# EAGLE design breakout_BGM111 (EAGLE 7.4.0)
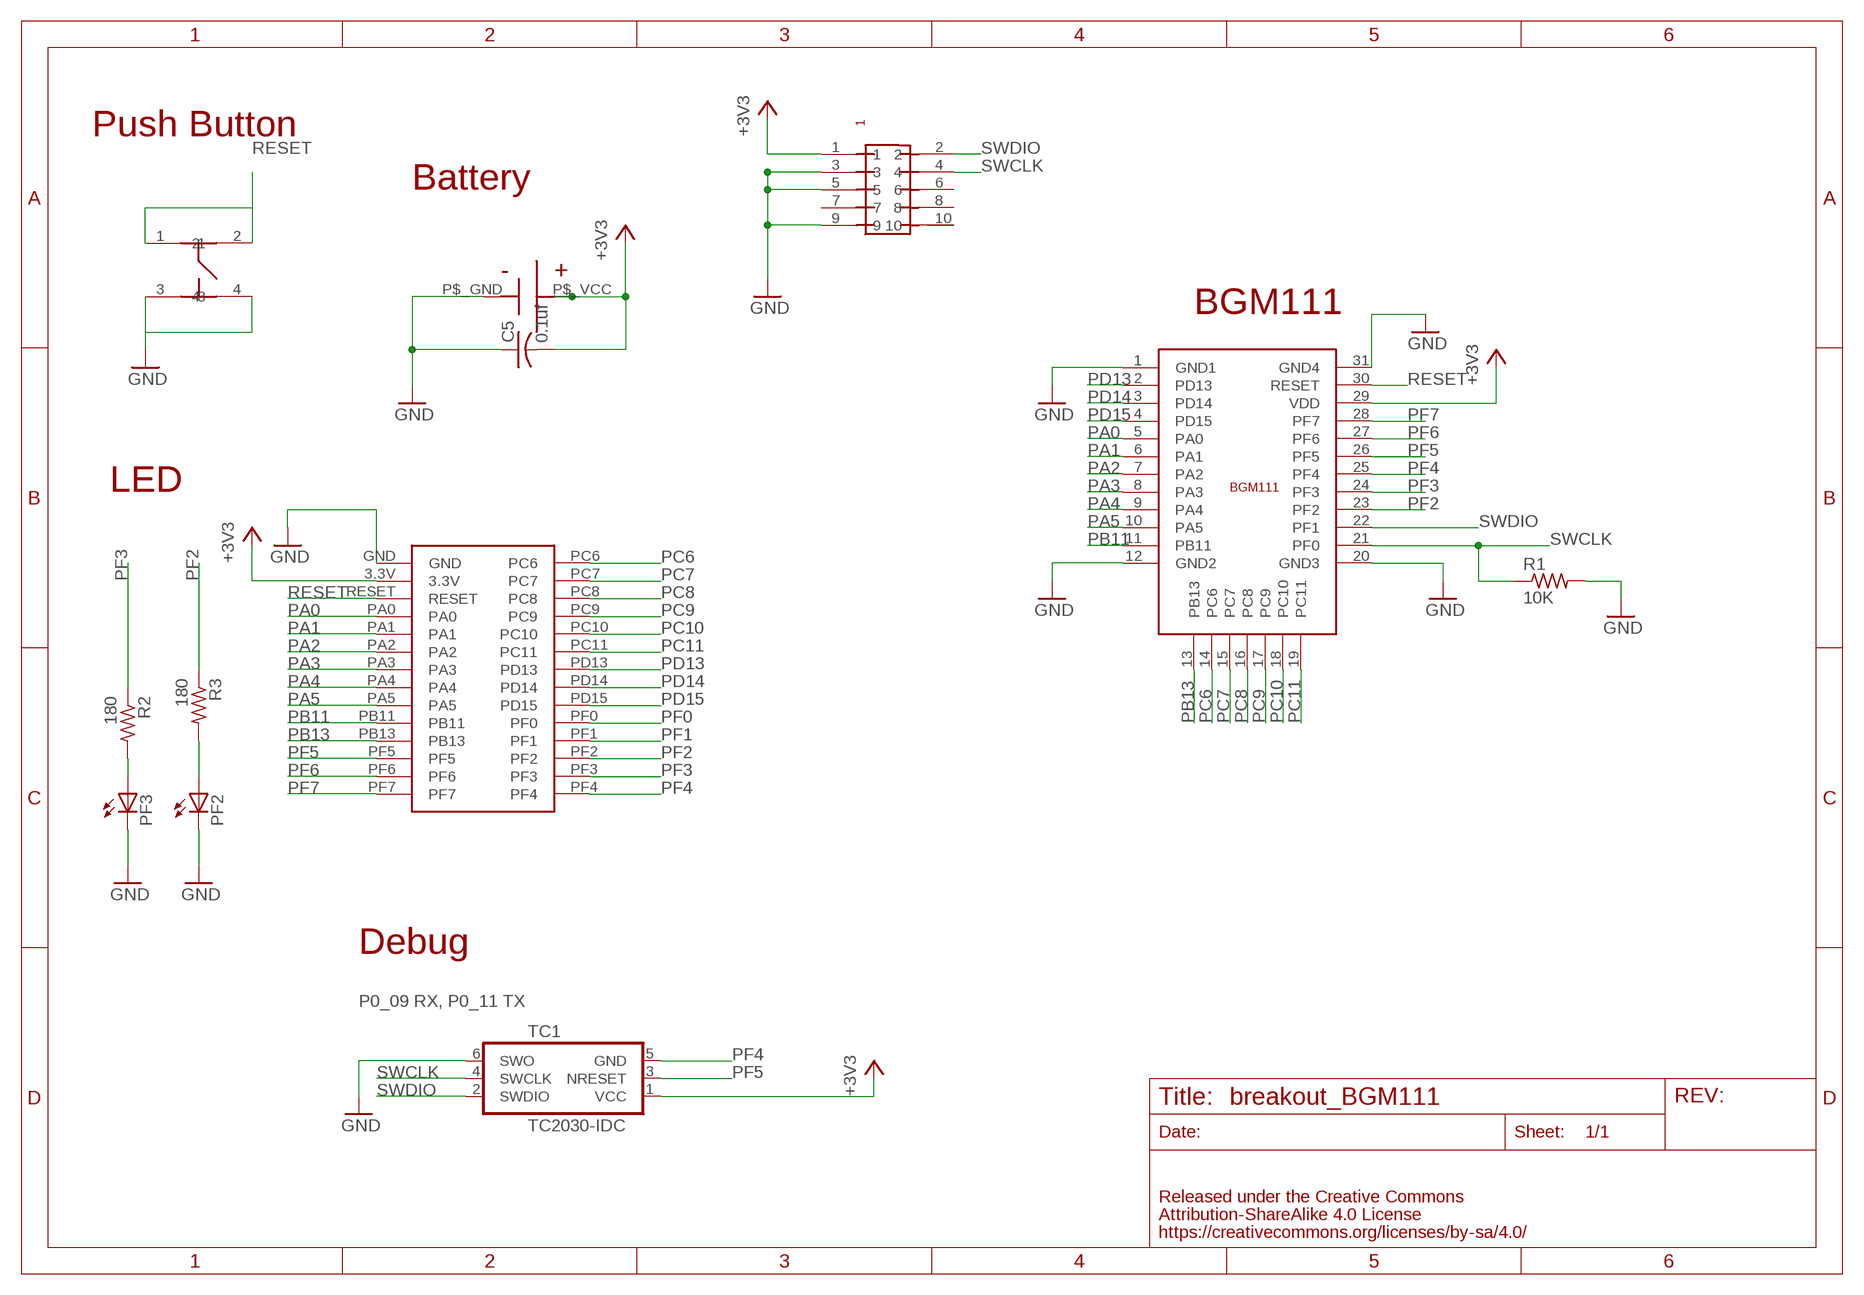
[diagram p0: schematic, sheet 1]

## Parts
C5  0.1uf  C-USC0603  [C0603]
PF2  LEDCHIP-LED0603  [CHIP-LED0603]
PF3  LEDCHIP-LED0603  [CHIP-LED0603]
R1  10K  R-US_R0603  [R0603]
R2  180  R-US_R0603  [R0603]
R3  180  R-US_R0603  [R0603]
TC1  TC2030-IDC  [TC2030-IDC]
U$1  SILICONLABS-BGM111  [SILICONLABS-BGM111]
U$2  SMTU2450-TOP  [SMTU2450]
U$3  BLE-BREAKOUT-NORDIC  [BLE-BREAKOUT-SILICONLABS]
U$4  PIN-HEADER-SMT(1.27MM)2X5  [PIN-HEADER-SMT(1.27MM)2X5]
U$5  SWICTH-4P(KMR2)  [SWITCH-4P(KMR2)]

## Nets
+3V3: C5.2 TC1.1(VCC) U$1.29(VDD) U$2.P$_VCC(+) U$3.3.3V U$4.1
GND: C5.1 PF2.C PF3.C R1.2 TC1.6(SWO) U$1.1(GND1) U$1.12(GND2) U$1.20(GND3) U$1.31(GND4) U$2.P$_GND(-) U$3.GND U$4.3 U$4.5 U$4.9 U$5.3 U$5.4
N$1: PF3.A R2.2
N$2: PF2.A R3.2
PA0: U$1.5(PA0) U$3.PA0
PA1: U$1.6(PA1) U$3.PA1
PA2: U$1.7(PA2) U$3.PA2
PA3: U$1.8(PA3) U$3.PA3
PA4: U$1.9(PA4) U$3.PA4
PA5: U$1.10(PA5) U$3.PA5
PB11: U$1.11(PB11) U$3.PB11
PB13: U$1.13(PB13) U$3.PB13
PC6: U$1.14(PC6) U$3.PC6
PC7: U$1.15(PC7) U$3.PC7
PC8: U$1.16(PC8) U$3.PC8
PC9: U$1.17(PC9) U$3.PC9
PC10: U$1.18(PC10) U$3.PC10
PC11: U$1.19(PC11) U$3.PC11
PD13: U$1.2(PD13) U$3.PD13
PD14: U$1.3(PD14) U$3.PD14
PD15: U$1.4(PD15) U$3.PD15
PF0: U$3.PF0
PF1: U$3.PF1
PF2: R3.1 U$1.23(PF2) U$3.PF2
PF3: R2.1 U$1.24(PF3) U$3.PF3
PF4: TC1.5(GND) U$1.25(PF4) U$3.PF4
PF5: TC1.3(NRESET) U$1.26(PF5) U$3.PF5
PF6: U$1.27(PF6) U$3.PF6
PF7: U$1.28(PF7) U$3.PF7
RESET: U$1.30(RESET) U$3.RESET U$5.1 U$5.2
RESET1: U$4.10
SWCLK: R1.1 TC1.4(SWCLK) U$1.21(PF0) U$4.4
SWDIO: TC1.2(SWDIO) U$1.22(PF1) U$4.2
Unconnected: U$4.6 U$4.7 U$4.8

## Notes on the sheet
- Push Button
- Battery
- BGM111
- LED
- Debug
- P0_09 RX, P0_11 TX

## Library data of the parts
C5 = adafruit:C-US: CAPACITOR, American symbol
PF2 PF3 = led:LED: LED OSRAM: - CHIPLED LG R971, LG N971, LY N971, LG Q971, LY Q971, LO R971, LY R971 LH N974, LH R974 LS Q976, LO Q976, LY Q976 LO Q996 - Hyper CHIPLED LW Q18S LB Q993, LB Q99A, LB R99A - SideLED LS A670, LO A670, LY A670, LG A670, LP A670 LB A673, LV A673, LT A673, LW A673 LH A674 LY A675 LS A676, LA A676, LO A676, LY A676, LW A676 LS A679, LY A679, LG A679 - Hyper Micro SIDELED® LS Y876, LA Y876, LO Y876, LY Y876 LT Y87S - SmartLED LW L88C, LW L88S LB L89C, LB L89S, LG L890 LS L89K, LO L89K, LY L89K LS L896, LA L896, LO L896, LY L896 - TOPLED LS T670, LO T670, LY T670, LG T670, LP T670 LSG T670, LSP T670, LSY T670, LOP T670, LYG T670 LG T671, LOG T671, LSG T671 LB T673, LV T673, LT T673, LW T673 LH T674 LS T676, LA T676, LO T676, LY T676, LB T676, LH T676, LSB T676, LW T676 LB T67C, LV T67C, LT T67C, LS T67K, LO T67K, LY T67K, LW E67C LS E67B, LA E67B, LO E67B, LY E67B, LB E67C, LV E67C, LT E67C LW T67C LS T679, LY T679, LG T679 LS T770, LO T770, LY T770, LG T770, LP T770 LB T773, LV T773, LT T773, LW T773 LH T774 LS E675, LA E675, LY E675, LS T675 LS T776, LA T776, LO T776, LY T776, LB T776 LHGB T686 LT T68C, LB T68C - Hyper Mini TOPLED® LB M676 - Mini TOPLED Santana® LG M470 LS M47K, LO M47K, LY M47K Source: http://www.osram.convergy.de LUXEON: - LUMILED® LXK2-PW12-R00, LXK2-PW12-S00, LXK2-PW14-U00, LXK2-PW14-V00 LXK2-PM12-R00, LXK2-PM12-S00, LXK2-PM14-U00 LXK2-PE12-Q00, LXK2-PE12-R00, LXK2-PE12-S00, LXK2-PE14-T00, LXK2-PE14-U00 LXK2-PB12-K00, LXK2-PB12-L00, LXK2-PB12-M00, LXK2-PB14-N00, LXK2-PB14-P00, LXK2-PB14-Q00 LXK2-PR12-L00, LXK2-PR12-M00, LXK2-PR14-Q00, LXK2-PR14-R00 LXK2-PD12-Q00, LXK2-PD12-R00, LXK2-PD12-S00 LXK2-PH12-R00, LXK2-PH12-S00 LXK2-PL12-P00, LXK2-PL12-Q00, LXK2-PL12-R00 Source: www.luxeon.com KINGBRIGHT: KA-3528ASYC Source: www.kingbright.com
R1-R3 = adafruit:R-US_: RESISTOR, American symbol
TC1 = TagConnect:TC2030-IDC: Tag-Connect In Circuit Programming & Debug Cable 6 Pin http://www.tag-connect.com
U$1 = FaBo-BT:SILICONLABS-BGM111
U$2 = GClue-Supply:SMTU2450-TOP
U$3 = FaBo-Template:BLE-BREAKOUT-NORDIC
U$4 = gclue:PIN-HEADER-SMT(1.27MM)2X5: PIN-HEADER-SMT (1.27MM) 2x5
U$5 = gclue-test:SWICTH-4P(KMR2)

## Board
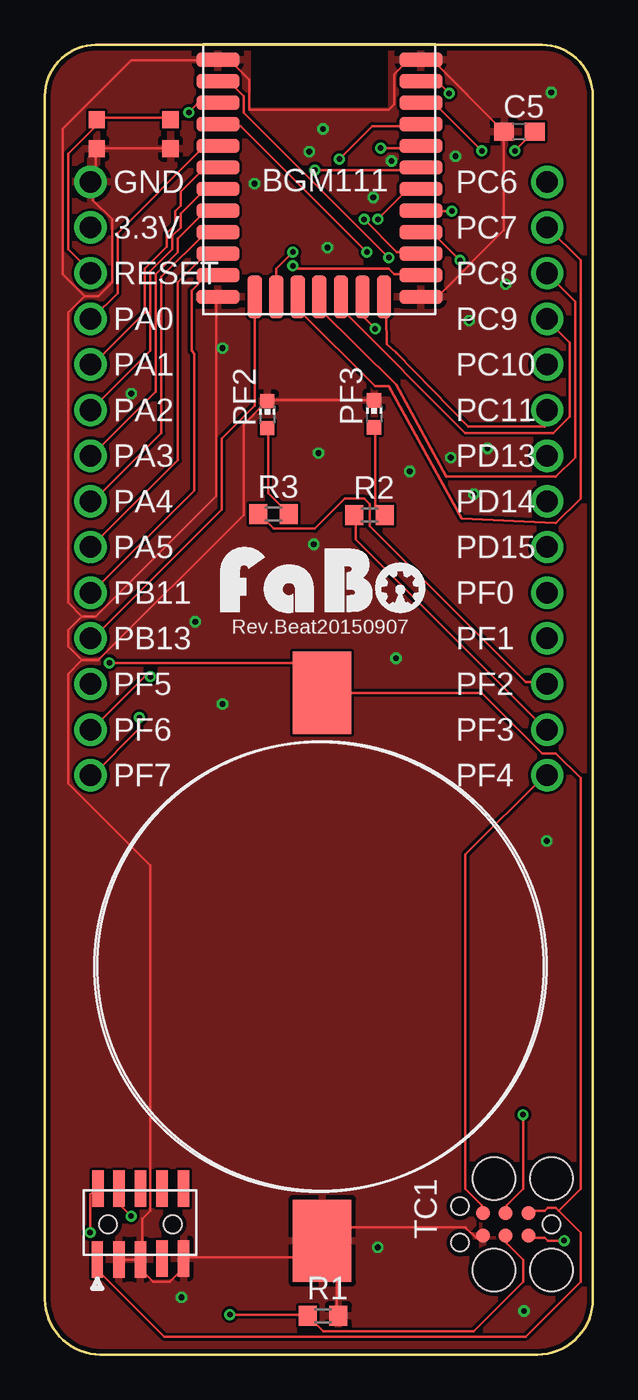
[diagram p1: board, top side]
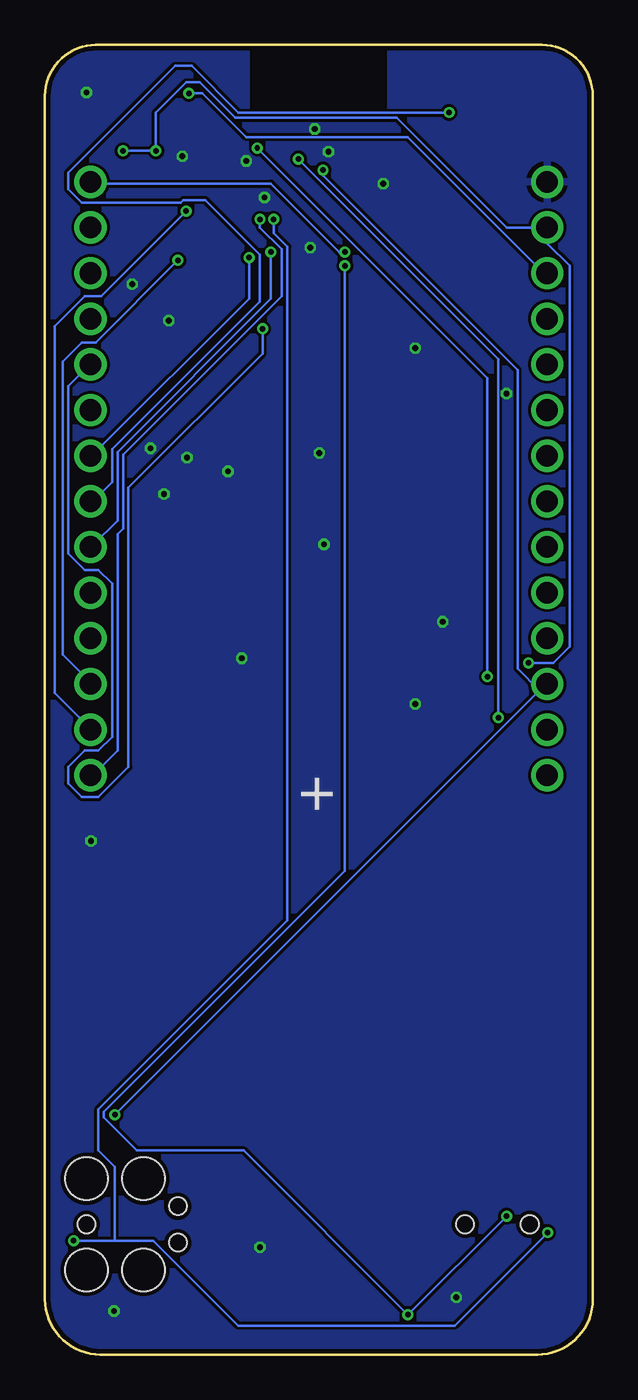
[diagram p2: board, bottom side, seen from below]

Size 30.48 x 72.88 mm. Coordinates in mm from the lower left corner, seen from the top.
Copper layers (1*16): Top 0.035mm / dielectric 1.5mm / Bottom 0.035mm
Design rules "SeeedStudio_2layer_DRU_no_angle_20140221": minimum track width 6mil, minimum drill 12mil, track to track 6mil, track to pad 6mil, pad to pad 6mil, via to via 6mil, smd to smd 0mil, copper to edge 10mil, drill to drill 10mil, minimum pad ring 10mil, minimum via ring 6mil, stop-mask expansion 2mil, vias tented up to drill 100mil, thermal gap 10mil

### Footprints (pad centres in the part's own frame; a part is rotated, then mirrored left to right if it is on the bottom)
C0603 = smd 1.1 x 1: 1 -0.85,0; 2 0.85,0
CHIP-LED0603 = smd 0.8 x 0.8: A 0,-0.75; C 0,0.75
R0603 = smd 1 x 1.1: 1 -0.85,0; 2 0.85,0
TC2030-IDC = smd 0.787 x 0.787: 1 -1.27,-0.635; 2 -1.27,0.635; 3 0,-0.635; 4 0,0.635; 5 1.27,-0.635; 6 1.27,0.635 | hole 0.991: -2.54,0; 2.54,1.016; 2.54,-1.016 | hole 2.375: -2.54,2.54; -2.54,-2.54; 0.635,2.54; 0.635,-2.54
SILICONLABS-BGM111 = smd 2.4 x 0.8: 1 -5.65,6.65; 2 -5.65,5.45; 3 -5.65,4.25; 4 -5.65,3.05; 5 -5.65,1.85; 6 -5.65,0.65; 7 -5.65,-0.55; 8 -5.65,-1.75; 9 -5.65,-2.95; 10 -5.65,-4.15; 11 -5.65,-5.35; 12 -5.65,-6.55; 20 5.65,-6.55; 21 5.65,-5.35; 22 5.65,-4.15; 23 5.65,-2.95; 24 5.65,-1.75; 25 5.65,-0.55; 26 5.65,0.65; 27 5.65,1.85; 28 5.65,3.05; 29 5.65,4.25; 30 5.65,5.45; 31 5.65,6.65 | smd 0.8 x 2.4: 13 -3.6,-6.55; 14 -2.4,-6.55; 15 -1.2,-6.55; 16 0,-6.55; 17 1.2,-6.55; 18 2.4,-6.55; 19 3.6,-6.55
SMTU2450 = smd 3.251 x 4.572: P$_GND 0,-15.29; P$_VCC 0,15.21
BLE-BREAKOUT-SILICONLABS = drill 1.2: 3.3V -12.7,26.67; GND -12.7,29.21; PA0 -12.7,21.59; PA1 -12.7,19.05; PA2 -12.7,16.51; PA3 -12.7,13.97; PA4 -12.7,11.43; PA5 -12.7,8.89; PB11 -12.7,6.35; PB13 -12.7,3.81; PC6 12.7,29.21; PC7 12.7,26.67; PC8 12.7,24.13; PC9 12.7,21.59; PC10 12.7,19.05; PC11 12.7,16.51; PD13 12.7,13.97; PD14 12.7,11.43; PD15 12.7,8.89; PF0 12.7,6.35; PF1 12.7,3.81; PF2 12.7,1.27; PF3 12.7,-1.27; PF4 12.7,-3.81; PF5 -12.7,1.27; PF6 -12.7,-1.27; PF7 -12.7,-3.81; RESET -12.7,24.13
PIN-HEADER-SMT(1.27MM)2X5 = smd 0.635 x 2.032: 1 -2.4,-1.95; 2 -2.35,2; 3 -1.2,-1.95; 4 -1.2,2; 5 0,-1.95; 6 0,2; 7 1.2,-1.9; 8 1.2,2; 9 2.4,-1.9; 10 2.4,2 | hole 1: 1.8,0; -1.8,0
SWITCH-4P(KMR2) = smd 0.9 x 0.95: 1 -1,0; 2 3.1,0; 3 -1,-1.6; 4 3.1,-1.6

### Placement (x,y rotation side)
C5  26.39,68.05 0 top
PF2  12.37,52.31 0 top
PF3  18.31,52.36 0 top
R1  15.47,2.17 0 top
R2  18.06,46.72 0 top
R3  12.73,46.77 0 top
TC1  25.63,7.25 180 top
U$1  15.27,65.41 0 top
U$2  15.42,21.62 0 top
U$3  15.24,36.05 0 top
U$4  5.31,7.25 0 top
U$5  3.89,68.71 0 top
U$7  [LOGO_FABO_M]  15.47,41.28 0 top

### Tracks (layer width: path | path; a pad name or v marks a point on that pad's centre or on a via)
+3V3  (via drill 0.3)
  Top 0.152: v26.14,66.99 27.2,68.05 C5.2 | v24.31,66.99 21.72,69.58 20.95,69.58 U$1.29 | 28.57,8.01 29.79,6.79 29.79,4.05 26.75,1 6.63,1 2.97,4.66 2.97,5.27 U$4.1 | 28.57,8.01 28.42,8.16 27.97,8.16 27.81,8.01 26.9,8.01 TC1.1 | 28.57,8.01 29.79,9.23 29.79,32.09 28.42,33.46 27.66,33.46 24.31,36.81 15.47,36.81 U$2.P$_VCC 15.32,36.96 13.79,38.49 v3.58,38.49
  Bottom 0.152: v26.14,66.99 v24.31,66.99 24.31,69.12 22.63,70.8 21.87,70.8 19.89,68.82 10.9,68.82 4.8,62.72 U$3.3.3V 2.51,62.72 2.51,61.81 1.3,60.59 1.3,39.4 2.21,38.49 v3.58,38.49
GND  (via drill 0.32)
  Top 0.152: 25.53,68.05 21.56,72.02 20.95,72.02 U$1.31 20.8,72.02 20.19,72.02 19.43,71.25 19.43,69.58 19.13,69.27 11.35,69.27 11.35,70.95 10.29,72.02 9.68,72.02 U$1.1 9.52,72.02 4.8,72.02 0.99,68.21 0.99,60.13 2.21,58.91 | 25.53,68.05 25.53,62.57 21.87,58.91 20.95,58.91 U$1.20 | 25.53,68.05 C5.1 | U$4.3 4.19,5.27 5.26,5.27 U$4.5 | U$4.5 5.41,5.27 5.41,4.66 6.02,4.05 6.93,4.05 7.7,4.81 7.7,5.27 U$4.9 7.85,5.42 14.4,5.42 15.32,6.33 U$2.P$_GND | TC1.6 24.31,6.48 24,6.48 23.39,7.09 16.08,7.09 15.47,6.48 U$2.P$_GND | R1.2 16.23,2.22 16.23,5.57 15.47,6.33 U$2.P$_GND | U$5.4 6.93,67.14 2.97,67.14 U$5.3 2.82,66.99 2.82,65.46 2.67,65.31 U$3.GND 2.67,65.16 2.67,64.24 3.73,63.18 3.73,59.67 2.97,58.91 2.21,58.91 | PF3.C 18.21,53.12 12.42,53.12 PF2.C 12.27,52.97 11.05,51.75 11.05,46.72 2.97,38.64 2.06,38.64 | 2.06,41.08 2.82,41.08 9.52,47.78 9.52,58.76 U$1.12 | 2.06,41.08 1.3,40.32 1.3,39.4 2.06,38.64 | 2.21,58.91 1.3,58 1.3,41.84 2.06,41.08 | 2.06,38.64 1.3,37.88 1.3,31.78 5.87,27.21 5.87,8.01 5.41,7.55 5.41,5.42 U$4.5
  other vias: 9.88,36.2 8.36,40.77 19.53,38.74 15.21,50.17 14.96,45.09 27.91,28.58 18.52,5.98 26.64,2.42 7.59,3.18 15.72,61.6 11.66,65.16 28.17,70.24 22.83,66.68 14.71,66.94 9.88,56.01 4.8,53.47 23.6,57.54 25.63,59.57 15.47,68.21 18.26,64.4 19.28,66.43 20.29,49.16 22.58,49.92 24.61,50.43 23.85,47.89
  pour Top: -2.31,-0.37 33.25,-0.37 33.25,73.29 -2.31,73.29
  pour Bottom: -2.31,-0.37 33.25,-0.37 33.25,73.29 -2.31,73.29
N$1
  Top 0.152: PF3.A 18.36,51.59 18.36,47.18 18.82,46.72 R2.2
N$2
  Top 0.152: PF2.A 12.42,51.44 12.42,47.94 13.49,46.87 R3.2
PA0
  Top 0.152: U$1.5 9.52,67.14 8.76,67.14 4.04,62.42 4.04,59.06 2.67,57.69 U$3.PA0
PA1
  Top 0.152: U$1.6 9.52,65.92 8.76,65.92 7.54,64.7 7.54,63.94 7.24,63.63 7.24,62.87 6.78,62.42 6.78,61.65 5.56,60.43 5.56,58 2.67,55.1 U$3.PA1
PA2
  Top 0.152: U$1.7 9.52,64.85 8.92,64.85 7.54,63.48 7.54,62.72 7.09,62.26 7.09,61.5 5.87,60.28 5.87,55.86 2.67,52.66 U$3.PA2
PA3
  Top 0.152: U$1.8 9.52,63.63 8.92,63.63 7.39,62.11 7.39,61.35 6.17,60.13 6.17,53.58 2.67,50.07 U$3.PA3
PA4
  Top 0.152: U$1.9 9.52,62.42 8.92,62.42 6.48,59.98 6.48,51.29 2.67,47.48 U$3.PA4
PA5
  Top 0.152: U$1.10 9.52,61.2 8.92,61.2 7.39,59.67 7.39,49.77 2.67,45.04 U$3.PA5
PB11
  Top 0.152: U$1.11 9.52,59.98 8.92,59.98 8.15,59.21 8.15,55.86 8.31,55.71 8.31,48.09 2.67,42.45 U$3.PB11
PB13
  Top 0.152: U$1.13 11.66,58.76 11.66,52.81 9.83,50.99 9.83,47.02 2.67,39.86 U$3.PB13
PC6  (via drill 0.3)
  Top 0.152: v13.79,61.35 12.88,60.43 12.88,58.91 U$1.14
  Bottom 0.152: v13.79,61.35 14.1,61.35 17.91,65.16 27.81,65.16 U$3.PC6
PC7
  Top 0.152: U$1.15 14.1,58.76 14.1,58.15 18.36,53.88 19.13,53.88 23.19,46.51 28.42,46.26 29.79,47.63 29.79,60.89 27.97,62.72 U$3.PC7
PC8
  Top 0.152: U$1.16 15.32,58.76 15.32,58.15 19.53,53.98 22.33,48.85 28.42,48.85 29.49,49.92 29.49,58.61 27.97,60.13 U$3.PC8
PC9
  Top 0.152: U$1.17 16.54,58.76 16.54,58.15 23.39,51.29 28.27,51.29 29.18,52.2 29.18,56.32 27.97,57.54 U$3.PC9
PC10  (via drill 0.3)
  Top 0.152: v18.36,57.08 17.75,57.69 17.75,58.76 U$1.18
  Bottom 0.152: v18.36,57.08 18.36,55.71 25.83,48.24 25.83,32.7 27.51,31.02 28.42,31.02 29.18,31.78 29.18,32.7 28.27,33.61 27.51,33.61 26.75,34.37 26.75,42.91 27.51,43.67 28.27,43.67 29.18,44.58 29.18,53.88 27.97,55.1 U$3.PC10
PC11
  Top 0.152: U$1.19 18.97,57.74 19.02,56.22 19.53,55.76 23.55,51.65 27.81,51.65 U$3.PC11
PD13  (via drill 0.3)
  Top 0.152: v19.13,61.04 11.05,69.12 11.05,70.04 10.29,70.8 9.68,70.8 U$1.2
  Bottom 0.152: v19.13,61.04 19.13,58.76 27.81,50.07 U$3.PD13
PD14  (via drill 0.3)
  Top 0.152: v8,69.12 8.46,69.58 9.52,69.58 U$1.3
  Bottom 0.152: v8,69.12 19.74,69.12 22.33,71.71 23.24,71.71 29.18,65.77 29.18,64.85 28.42,64.09 22.94,64.09 22.78,64.24 21.56,64.24 18.52,61.2 18.52,58.61 26.75,50.38 26.75,48.55 27.81,47.48 U$3.PD14
PD15  (via drill 0.3)
  Top 0.152: v17.91,61.35 10.9,68.36 9.68,68.36 U$1.4
  Bottom 0.152: v17.91,61.35 17.91,58.76 26.44,50.22 26.44,46.41 27.81,45.04 U$3.PD15
PF2  (via drill 0.3)
  Top 0.152: R3.1 11.96,46.72 12.73,45.96 15.01,45.96 16.69,47.63 17.75,47.63 18.06,47.33 18.06,46.11 26.75,37.42 27.81,37.42 U$3.PF2 | v23.09,60.89 21.56,62.42 20.95,62.42 U$1.23
  Bottom 0.152: v23.09,60.89 27.66,56.32 28.42,56.32 29.49,55.25 29.49,38.95 27.97,37.42 U$3.PF2
PF3  (via drill 0.3)
  Top 0.152: R2.1 17.3,46.72 17.3,45.35 27.81,34.83 U$3.PF3 | v22.63,63.63 20.95,63.63 U$1.24
  Bottom 0.152: v22.63,63.63 27.36,58.91 28.27,58.91 29.95,57.23 29.95,36.81 27.97,34.83 U$3.PF3
PF4  (via drill 0.3)
  Top 0.152: TC1.5 24.31,8.01 24.31,8.31 23.39,9.23 23.39,27.82 27.81,32.24 U$3.PF4 | v18.52,63.18 20.19,64.85 20.8,64.85 U$1.25
  Bottom 0.152: v18.52,63.18 18.52,62.72 17.3,61.5 17.3,58.91 26.14,50.07 26.14,45.96 26.44,45.65 26.44,33.61 27.81,32.24 U$3.PF4
PF5  (via drill 0.3)
  Top 0.152: v26.59,13.34 26.59,9.23 25.68,8.31 25.68,8.01 TC1.3 | v15.01,65.92 20.8,65.92 U$1.26
  Bottom 0.152: 2.97,36.96 2.67,37.27 U$3.PF5 2.97,36.96 | 2.97,36.96 v26.59,13.34 | v15.01,65.92 15.01,65.62 4.19,54.8 4.19,38.18 2.97,36.96
PF6  (via drill 0.3)
  Top 0.152: v18.67,67.14 20.8,67.14 U$1.27 | v5.87,37.73 5.56,37.73 2.67,34.83 U$3.PF6
  Bottom 0.152: v18.67,67.14 5.87,54.34 v5.87,37.73
PF7  (via drill 0.3)
  Top 0.152: v16.38,66.53 18.21,68.36 20.8,68.36 U$1.28 | v5.26,35.44 5.26,34.83 2.67,32.24 U$3.PF7
  Bottom 0.152: v16.38,66.53 5.26,55.4 v5.26,35.44
RESET  (via drill 0.3)
  Top 0.152: U$5.2 6.93,68.82 2.97,68.82 U$5.1 2.82,68.66 2.82,68.36 1.3,66.83 1.3,61.5 2.51,60.28 U$3.RESET | v22.48,70.19 21.87,70.8 20.95,70.8 U$1.30
  Bottom 0.152: v22.48,70.19 21.72,70.19 19.28,67.75 10.29,67.75 2.67,60.13 U$3.RESET
SWCLK  (via drill 0.3)
  Top 0.152: TC1.4 25.68,6.48 25.68,6.18 26.59,5.27 26.59,4.05 23.85,1.3 15.47,1.3 14.71,2.06 R1.1 14.55,2.22 v10.29,2.22 | v4.8,7.7 4.19,8.31 4.19,9.23 U$4.4 | v13.79,60.59 13.94,60.43 19.13,60.43 19.43,60.13 20.8,60.13 U$1.21
  Bottom 0.152: v4.8,7.7 v10.29,2.22 19.43,11.36 25.37,11.36 27.2,13.19 27.2,13.49 13.79,26.91 v13.79,60.59
SWDIO  (via drill 0.3)
  Top 0.152: v28.88,6.33 27.97,6.33 27.81,6.48 26.9,6.48 TC1.2 | v2.51,6.79 2.51,8.92 2.82,9.23 U$4.2 | v17.75,63.18 19.58,61.35 20.8,61.35 U$1.22
  Bottom 0.152: 26.59,6.33 24.46,6.33 19.74,1.61 7.7,1.61 v2.51,6.79 | 26.59,6.33 v28.88,6.33 | v17.75,63.18 17.75,62.42 16.99,61.65 16.99,24.16 27.51,13.65 27.51,11.36 26.59,10.45 26.59,6.33

### Text on the board
tPlace: Rev.Beat20150907